# Altium schematic sheet misc.SchDoc: Misc Components
size A4; Organization: heig-vd; Address1: heig-vd; Address2: Route de Cheseaux 1; Address3: 1401 Yverdon-les-Bains; Address4: Suisse; DocumentNumber: 12; Revision: 1.1; SheetNumber: 12; SheetTotal: 12
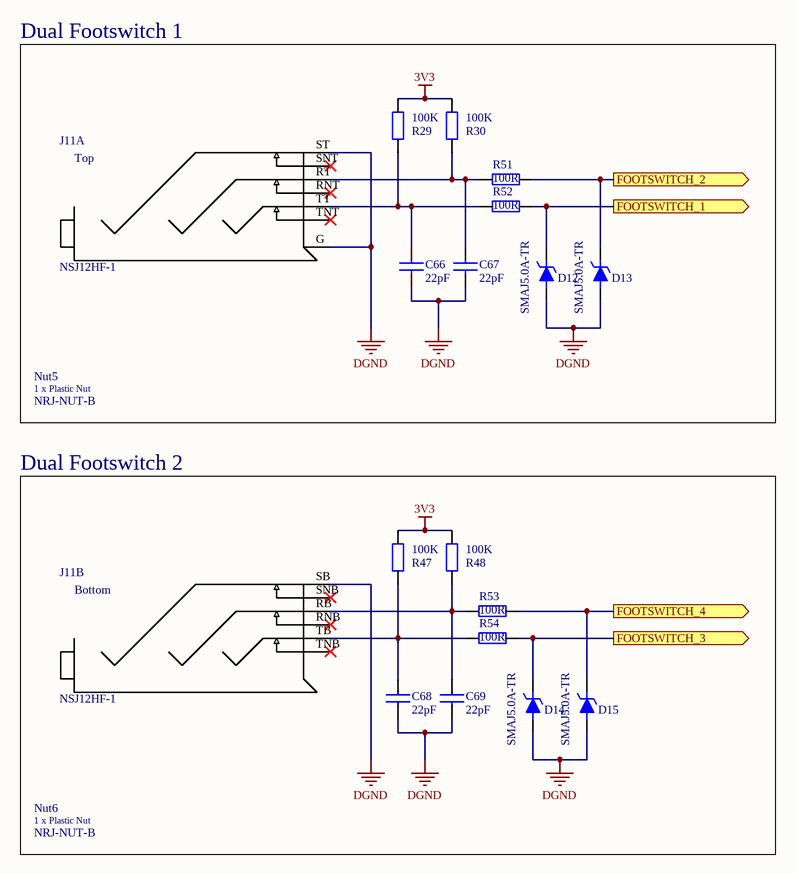
[diagram p0: misc.SchDoc]

## Parts
C66  22pF  [SM/C_0603]
C67  22pF  [SM/C_0603]
C68  22pF  [SM/C_0603]
C69  22pF  [SM/C_0603]
D12  SMAJ5.0A-TR  [SM/D_DO214-AC (SMA)]
D13  SMAJ5.0A-TR  [SM/D_DO214-AC (SMA)]
D14  SMAJ5.0A-TR  [SM/D_DO214-AC (SMA)]
D15  SMAJ5.0A-TR  [SM/D_DO214-AC (SMA)]
J11  NSJ12HF-1  [NSJ12HF-1]  (parts A,B of 2)
Nut5  NRJ-NUT-B  (mechanical)
Nut6  NRJ-NUT-B  (mechanical)
R29  100K  [SM/R_0603]
R30  100K  [SM/R_0603]
R47  100K  [SM/R_0603]
R48  100K  [SM/R_0603]
R51  100R  [SM/R_0603]
R52  100R  [SM/R_0603]
R53  100R  [SM/R_0603]
R54  100R  [SM/R_0603]

## Blocks framed on the sheet
Dual Footswitch 1: C66 C67 D12 D13 J11 Nut5 R29 R30 R51 R52
Dual Footswitch 2: C68 C69 D14 D15 J11 Nut6 R47 R48 R53 R54

## Ports
FOOTSWITCH_1 (out), FOOTSWITCH_2 (out), FOOTSWITCH_3 (out), FOOTSWITCH_4 (out)

## Nets
3V3: R29.1 R30.1 R47.1 R48.1
DGND: C66.2 C67.2 C68.2 C69.2 D12.1(A) D13.1(A) D14.1(A) D15.1(A) J11.G J11.SB J11.ST
FOOTSWITCH_1: D12.2(C) R52.2 ; port FOOTSWITCH_1
FOOTSWITCH_2: D13.2(C) R51.2 ; port FOOTSWITCH_2
FOOTSWITCH_3: D14.2(C) R54.2 ; port FOOTSWITCH_3
FOOTSWITCH_4: D15.2(C) R53.2 ; port FOOTSWITCH_4
NetC66_1: C66.1 J11.TT R29.2 R52.1
NetC67_1: C67.1 J11.RT R30.2 R51.1
NetC68_1: C68.1 J11.TB R47.2 R54.1
NetC69_1: C69.1 J11.RB R48.2 R53.1

Not connected (* = marked no-connect by the designer): J11 RNB* RNT* SNB* SNT* TNB* TNT*

## Notes on the sheet
- Route de Cheseaux 1
- CH-1401 Yverdon-les-Bains
- Titre:
- Date:
- Projet:
- Revision:
- Sheet
- of
- File:
- (in symbol Jack 6.35 NSJ12HF-1, part A) Top
- (in symbol Jack 6.35 NSJ12HF-1, part B) Bottom
- (in symbol Jack 6.35 Plastic Nut) 1 x Plastic Nut

## Library data of the parts
C66-C69 = 216: Capacitor, ceramic; Manufacturer: Kemet; Manufacturer P/N: C0603C220J5GAC; ID: 216; Voltage: 50V; Tolerance: ±5%; Value: 22pF; Component Type: Capacitor, non-polarized; Supplier 1: Farnell; Supplier Part Number 1: 1414622; RoHS Compliant: True
D12-D15 = 556: Transil™ diode; Manufacturer: STMicroelectronics; ID: 556; Component Type: Diode TVS; Manufacturer P/N: SMAJ5.0A-TR; Value: SMAJ5.0A-TR; Supplier 1: Farnell; Supplier Part Number 1: 1467627; RoHS Compliant: False
J11 = Jack 6.35 NSJ12HF-1: Neutronik 2xJack 6.35 connector; Supplier 1: Allied; Supplier 2: Newark; Supplier 3: Mouser; Supplier Part Number 1: 70549361; Supplier Part Number 2: 10J0817; Supplier Part Number 3: 568-NSJ12HF-1
Nut5 Nut6 = Jack 6.35 Plastic Nut: Plastic Nut to fasten 6.35 jack; Manufacturer: Neutrik; Manufacturer P/N: NRJ-NUT-B; Supplier 1: Mouser; Supplier 2: Allied; Supplier Part Number 1: 550-1005; Supplier Part Number 2: 70088339
R29 R30 R47 R48 = 157: Résistance 0603 63mW 1% 100K; Manufacturer: Multicomp; Manufacturer P/N: MC 0.036mW 0603 1% 100K; ID: 157; Voltage: 50V; Value: 100K; Component Type: Résistance; Power: 63mW; Tolerance: 1%; Supplier 1: Farnell; Supplier Part Number 1: 9330402; RoHS Compliant: False
R51-R54 = 85: Résistance 0603 63mW 1% 100R; Manufacturer: Multicomp; Manufacturer P/N: MC 0.036mW 0603 1% 100R; ID: 85; Voltage: 50V; Value: 100R; Component Type: Résistance; Power: 63mW; Tolerance: 1%; Supplier 1: Farnell; Supplier Part Number 1: 9330364; RoHS Compliant: False